# Altium schematic sheet 03 24V-5V.SchDoc
size A
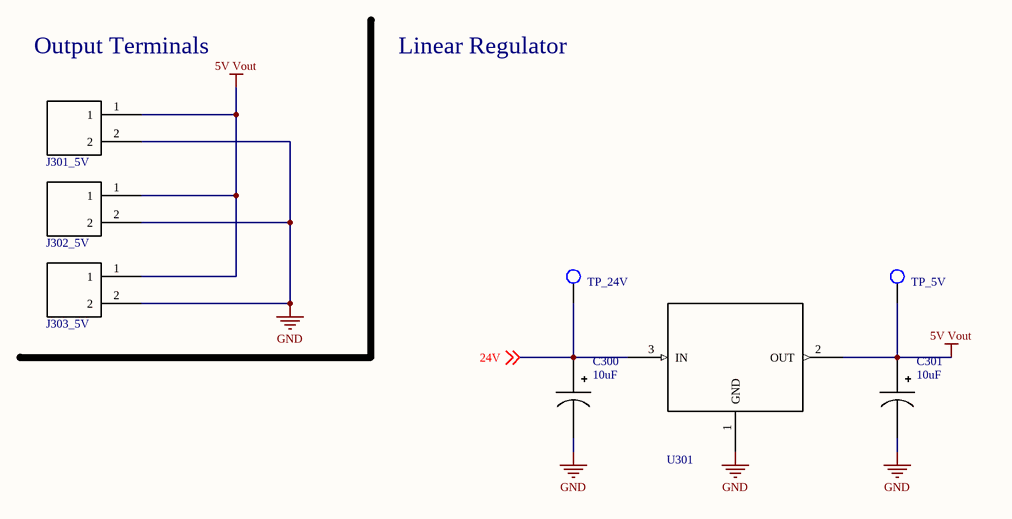
[diagram p0: 03 24V-5V.SchDoc]

## Parts
C300  Capacitance: 10uF  [CAP_1207_POL]  (hidden comment: CAP_10uF_TANT)
C301  Capacitance: 10uF  [CAP_1207_POL]  (hidden comment: CAP_10uF_TANT)
J301_5V  TERMINAL_SCREW_2x1  [TERM_2Pin]  (value not drawn)
J302_5V  TERMINAL_SCREW_2x1  [TERM_2Pin]  (value not drawn)
J303_5V  TERMINAL_SCREW_2x1  [TERM_2Pin]  (value not drawn)
TP_5V  TP_1206  [TP-SMC-1206]  (value not drawn)
TP_24V  TP_1206  [TP-SMC-1206]  (value not drawn)
U301  BUCK_LM1084IS-5.0  [BUCK_5V_OUT_FIXED]  (value not drawn)

## Nets
5V Vout: C301.1(+) J301_5V.1 J302_5V.1 J303_5V.1 TP_5V.1 U301.2(OUT)
GND: C300.2(-) C301.2(-) J301_5V.2 J302_5V.2 J303_5V.2 U301.1(GND)
24V: C300.1(+) TP_24V.1 U301.3(IN) ; off-sheet 24V

## Notes on the sheet
- Output Terminals
- Linear Regulator

## Library data of the parts
C300 C301 = CAP_10uF_TANT: Manufacturer: AVX Corporation; Manufacturer Part Number: F951E106MAAAQ2; Manufacturer Size Code: A; Tolerance: ±20%; Type: Conformal Coated; ESR (Equivalent Series Resistance): 2 Ohm; Notification: Current market demand for these product types have resulted in fluctuating and extending lead times. Lead times may differ.; Supplier 1: Digi-Key; RoHS: RoHS Compliant; Category: Capacitors; Stock 1: 23690; Pricing 1: 1=1.01, 10=0.766, 100=0.5477, 500=0.42406, 1000=0.36516 (USD); Packaging: Cut Tape (CT); Part Status: Active; Operating Temperature: -55°C ~ 125°C; Lifetime @ Temp.: -; Mounting Type: Surface Mount; Package / Case: 1206 (3216 Metric); Size / Dimension: 0.126" L x 0.067" W (3.20mm x 1.70mm); Height - Seated (Max): 0.063" (1.60mm); Lead Spacing: -; Features: General Purpose; Failure Rate: -; ComponentLink1URL: http://datasheets.avx.com/F95.pdf; ComponentLink1Description: http://datasheets.avx.com/F95.pdf; Supplier Part Number 1: 478-8496-1-ND
J301_5V J302_5V J303_5V = TERMINAL_SCREW_2x1: TERM BLOCK PLUG 2POS STR 5.08MM; Manufacturer: On Shore Technology Inc.; Manufacturer Part Number: OSTTJ025153; Number of Positions: 2; Number of Levels: 1; Pitch: 0.200" (5.08mm); Current - IEC: 20A; Wire Gauge or Range - AWG: 12-24 AWG; Wire Gauge or Range - mm²: 0.34-2.5mm²; Material Flammability Rating: UL94 V-0; Torque - Screw: 0.56 Nm (5.0 Lb-In); Wire Strip Length: 7-8mm; Mating Orientation: Horizontal with Board; Wire Gauge: 10-30 AWG; Wire Termination: Screw; Clamp Material - Plating: Copper - Nickel Plated; Description: EUROSTYLE 9.53 FIXED PIN 2 CIR; RoHS: RoHS Compliant; Category: Connectors, Interconnects; Packaging: Bulk; Part Status: Active; Type: Plug, Female Sockets; Positions Per Level: 2; Header Orientation: -; Plug Wire Entry: -; Termination Style: Screw; Mounting Type: Screw; Color: Green; Operating Temperature: -30°C ~ 105°C; Contact Mating Finish: Tin; Features: Retention Latches (Non-Wire Side); Ingress Protection: -; Screw Size: -; Contact Material: Brass; Housing Material: Brass; Contact Tail Length: -; Insulation Height: -; ComponentLink1URL: http://www.on-shore.com/wp-content/uploads/2015/09/osttjxx5153.pdf; ComponentLink1Description: http://www.on-shore.com/wp-content/uploads/2015/09/osttjxx5153.pdf; Supplier 1: Digi-Key; Stock 1: 1303; Pricing 1: 1=1.52, 10=1.068, 25=0.996, 50=0.904, 100=0.9, 250=0.76, 500=0.72, 1000=0.64, 5000=0.52 (USD); Contact Material - Plating: Copper - Tin Plated; Screw Material - Plating: Copper - Nickel Plated; Screw Thread: -; ComponentLink2URL: http://www.molex.com/pdm_docs/sd/393900102_sd.pdf; ComponentLink2Description: http://www.molex.com/pdm_docs/sd/393900102_sd.pdf; Supplier Part Number 1: WM13946-ND
TP_5V TP_24V = TP_1206: Test Point SMD 1206; Manufacturer: TE Connectivity (Tyco Electronics); Manufacturer Part Number: 1625854-1; Resistance Value: 0 Ohm; Temperature Coefficient: N/R; Supplier 1: Digi-Key; Stock 1: 31937; Pricing 1: 1=0.28, 10=0.261, 25=0.224, 50=0.1902, 100=0.1828, 250=0.1641, 500=0.1567, 1000=0.1306 (USD); Case Size: 1206; Dimension: 3.2 x 1.6 x 1.25mm; Family: RC; Mounting: Surface Mount; Operating Temperature: -55 to 125 C; Part No: 1625854-1; RoHS: Yes; Packaging: Tape and Reel; Termination Style: N/R; Terminal Pitch: N/R; Power Rating: N/R; Tolerance: N/R; ComponentLink1URL: https://datasheet.ciiva.com/6439/eng-ds-1773266-a-6439169.pdf; ComponentLink1Description: https://datasheet.ciiva.com/6439/eng-ds-1773266-a-6439169.pdf; ComponentLink2URL: https://datasheet.ciiva.com/30136/1773266-a-30136341.pdf; ComponentLink2Description: https://datasheet.ciiva.com/30136/1773266-a-30136341.pdf; ComponentLink3URL: https://datasheet.ciiva.com/6439/eng-ds-1773266-a-6439080.pdf; ComponentLink3Description: https://datasheet.ciiva.com/6439/eng-ds-1773266-a-6439080.pdf; ComponentLink4URL: https://datasheet.ciiva.com/6439/eng-ds-1773266-a-6439081.pdf; ComponentLink4Description: https://datasheet.ciiva.com/6439/eng-ds-1773266-a-6439081.pdf; ComponentLink5URL: https://datasheet.ciiva.com/6439/eng-ds-1773266-a-6439083.pdf; ComponentLink5Description: https://datasheet.ciiva.com/6439/eng-ds-1773266-a-6439083.pdf; Supplier Part Number 1: A106143CT-ND
U301 = BUCK_LM1084IS-5.0: Manufacturer: Texas Instruments; Manufacturer Part Number: LM1084ISX-5.0/NOPB; Output Configuration: Positive; Output Type: Fixed; Voltage - Input (Max): 25V; Voltage - Output (Min/Fixed): 5V; Voltage Dropout (Max): 1.5V @ 5A; Current - Output: 5A; PSRR: 68dB (120Hz); Protection Features: Over Current, Over Temperature; Supplier 1: Digi-Key; RoHS: RoHS Compliant; Category: Integrated Circuits (ICs); Stock 1: 431; Pricing 1: 1=2.73, 10=2.451, 100=1.9701 (USD); Packaging: Cut Tape (CT); Part Status: Active; Voltage - Output (Max): -; Control Features: -; Operating Temperature: -40°C ~ 125°C; Mounting Type: Surface Mount; Package / Case: TO-263-4, D²Pak (3 Leads + Tab), TO-263AA; Supplier Device Package: DDPAK/TO-263-3; Base Part Number: LM1084; ComponentLink1URL: http://www.ti.com/lit/ds/symlink/lm1084.pdf; ComponentLink1Description: http://www.ti.com/lit/ds/symlink/lm1084.pdf; Supplier Part Number 1: LM1084ISX-5.0/NOPBCT-ND